# Altium schematic sheet LC_OUTPUTS.SchDoc
size A
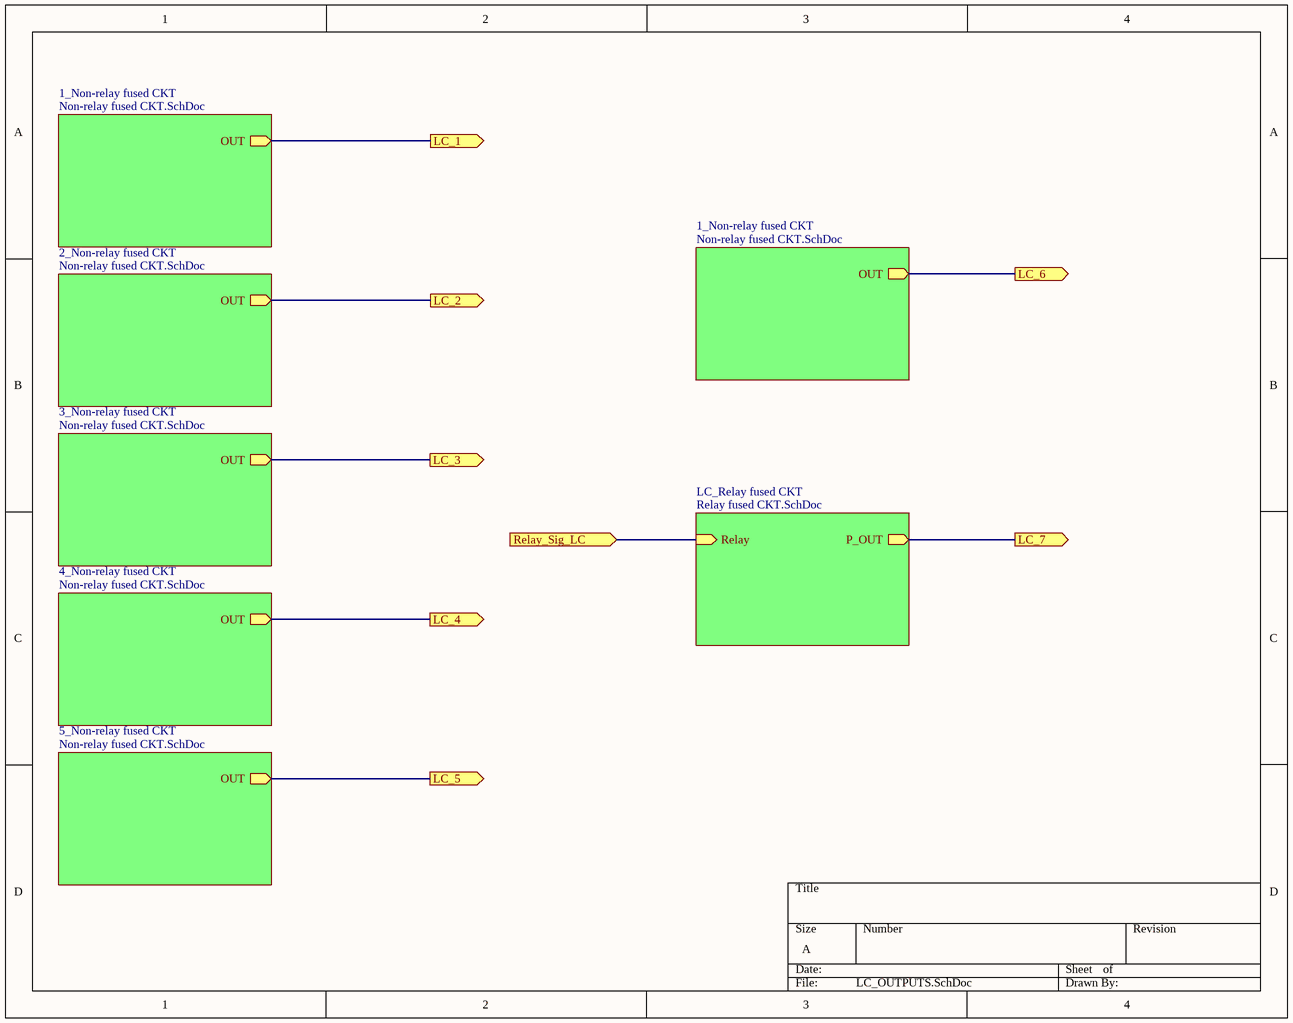
[diagram p0: LC_OUTPUTS.SchDoc]

## Sub-sheets
1_Non-relay fused CKT = Non-relay fused CKT.SchDoc: OUT (out)
1_Non-relay fused CKT = Non-relay fused CKT.SchDoc: OUT (out)
2_Non-relay fused CKT = Non-relay fused CKT.SchDoc: OUT (out)
3_Non-relay fused CKT = Non-relay fused CKT.SchDoc: OUT (out)
4_Non-relay fused CKT = Non-relay fused CKT.SchDoc: OUT (out)
5_Non-relay fused CKT = Non-relay fused CKT.SchDoc: OUT (out)
LC_Relay fused CKT = Relay fused CKT.SchDoc: P_OUT (out), Relay (in)

## Ports
LC_1 (out), LC_2 (out), LC_3 (out), LC_4 (out), LC_5 (out), LC_6 (out), LC_7 (out), Relay_Sig_LC (in)

## Nets
LC_1: port LC_1, sheet 1_Non-relay fused CKT/OUT
LC_2: port LC_2, sheet 2_Non-relay fused CKT/OUT
LC_3: port LC_3, sheet 3_Non-relay fused CKT/OUT
LC_4: port LC_4, sheet 4_Non-relay fused CKT/OUT
LC_5: port LC_5, sheet 5_Non-relay fused CKT/OUT
LC_6: port LC_6, sheet 1_Non-relay fused CKT/OUT
LC_7: port LC_7, sheet LC_Relay fused CKT/P_OUT
Relay_Sig_LC: port Relay_Sig_LC, sheet LC_Relay fused CKT/Relay